# Altium schematic sheet LVDS_TX.SchDoc
size A4; SheetNumber: 3; SheetTotal: 6
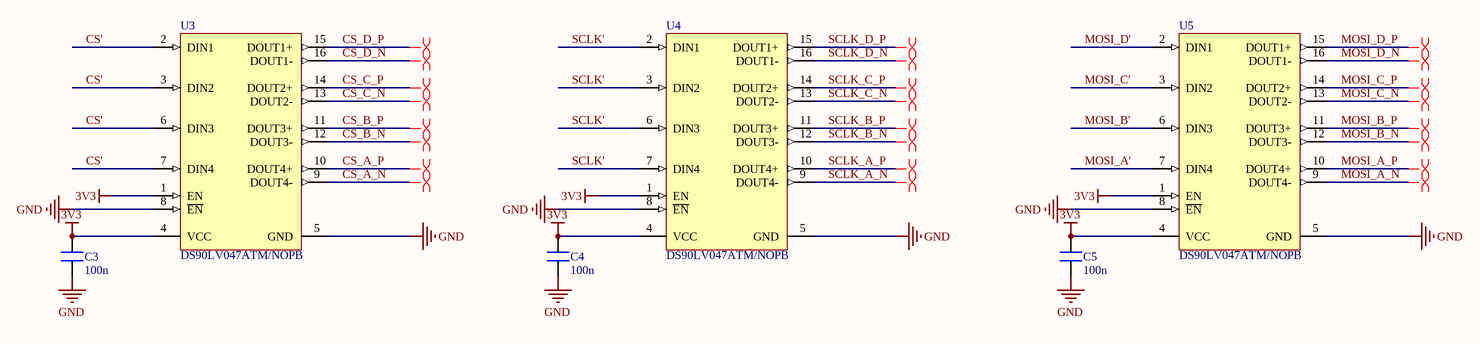
[diagram p0: LVDS_TX.SchDoc]

## Parts
C3  100n  [C 0402_L]
C4  100n  [C 0402_L]
C5  100n  [C 0402_L]
U3  DS90LV047ATM/NOPB  [D0016A_L]
U4  DS90LV047ATM/NOPB  [D0016A_L]
U5  DS90LV047ATM/NOPB  [D0016A_L]

## Nets
3V3: C3.2 C4.2 C5.2 U3.1(EN) U3.4(VCC) U4.1(EN) U4.4(VCC) U5.1(EN) U5.4(VCC)
GND: C3.1 C4.1 C5.1 U3.5(GND) U3.8(~{EN}) U4.5(GND) U4.8(~{EN}) U5.5(GND) U5.8(~{EN})
CS': U3.2(DIN1) U3.3(DIN2) U3.6(DIN3) U3.7(DIN4)
CS_A_N: U3.9(DOUT4-)
CS_A_P: U3.10(DOUT4+)
CS_B_N: U3.12(DOUT3-)
CS_B_P: U3.11(DOUT3+)
CS_C_N: U3.13(DOUT2-)
CS_C_P: U3.14(DOUT2+)
CS_D_N: U3.16(DOUT1-)
CS_D_P: U3.15(DOUT1+)
MOSI_A': U5.7(DIN4)
MOSI_A_N: U5.9(DOUT4-)
MOSI_A_P: U5.10(DOUT4+)
MOSI_B': U5.6(DIN3)
MOSI_B_N: U5.12(DOUT3-)
MOSI_B_P: U5.11(DOUT3+)
MOSI_C': U5.3(DIN2)
MOSI_C_N: U5.13(DOUT2-)
MOSI_C_P: U5.14(DOUT2+)
MOSI_D': U5.2(DIN1)
MOSI_D_N: U5.16(DOUT1-)
MOSI_D_P: U5.15(DOUT1+)
SCLK': U4.2(DIN1) U4.3(DIN2) U4.6(DIN3) U4.7(DIN4)
SCLK_A_N: U4.9(DOUT4-)
SCLK_A_P: U4.10(DOUT4+)
SCLK_B_N: U4.12(DOUT3-)
SCLK_B_P: U4.11(DOUT3+)
SCLK_C_N: U4.13(DOUT2-)
SCLK_C_P: U4.14(DOUT2+)
SCLK_D_N: U4.16(DOUT1-)
SCLK_D_P: U4.15(DOUT1+)

## Layout directives
differential pair: CS_A_N, CS_A_P, CS_B_N, CS_B_P, CS_C_N, CS_C_P, CS_D_N, CS_D_P, MOSI_A_N, MOSI_A_P, MOSI_B_N, MOSI_B_P, MOSI_C_N, MOSI_C_P, MOSI_D_N, MOSI_D_P, SCLK_A_N, SCLK_A_P, SCLK_B_N, SCLK_B_P, SCLK_C_N, SCLK_C_P, SCLK_D_N, SCLK_D_P

## Library data of the parts
C3-C5 = C_1
U3-U5 = CMP-0058-01043-3: 3V LVDS Quad CMOS Differential Line Driver, 16-pin Narrow SOIC, Pb-Free; Manufacturer: Texas Instruments; PowerWise: N; PackageTopMarking: NS2ZXYTTE#*DS90LV047A*TM; CompType: Interface IC; PinCount: 16; RoHS: Y; Code_IPC: SOIC127P600-16; PackageReference: D0016A; ComponentLink1URL: http://www.ti.com/general/docs/lit/getliterature.tsp?genericPartNumber=DS90LV047A&fileType=pdf; Code_JEDEC: MS-012-AC; PackageDescription: Molded Package, SO, .150in Wide, 16 Lead; ComponentLink1Description: Datasheet URL